# EAGLE design led+but (EAGLE 5.04)
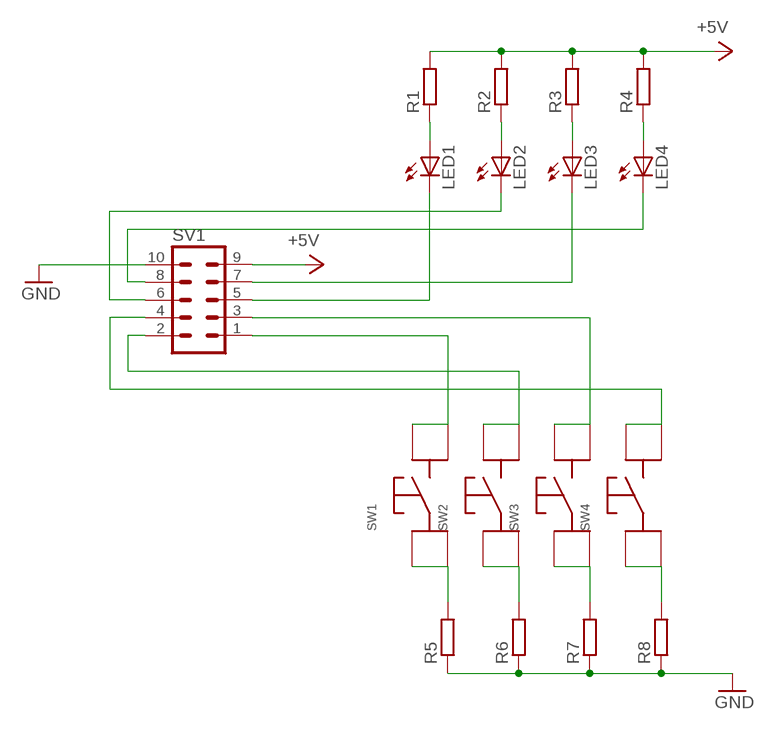
[diagram p0: schematic, sheet 1]

## Parts
LED1  LED3MM  [LED3MM]
LED2  LED3MM  [LED3MM]
LED3  LED3MM  [LED3MM]
LED4  LED3MM  [LED3MM]
R1  R-EU_R0805  [R0805]
R2  R-EU_R0805  [R0805]
R3  R-EU_R0805  [R0805]
R4  R-EU_R0805  [R0805]
R5  R-EU_R0805  [R0805]
R6  R-EU_R0805  [R0805]
R7  R-EU_R0805  [R0805]
R8  R-EU_R0805  [R0805]
SV1  MA05-2  [MA05-2]
SW1  PUSHBUTTON_6X6X5MM  [TACT_6X6X5MM]
SW2  PUSHBUTTON_6X6X5MM  [TACT_6X6X5MM]
SW3  PUSHBUTTON_6X6X5MM  [TACT_6X6X5MM]
SW4  PUSHBUTTON_6X6X5MM  [TACT_6X6X5MM]

## Nets
+5V: R1.2 R2.2 R3.2 R4.2 SV1.9
GND: R5.1 R6.1 R7.1 R8.1 SV1.10
N$1: R5.2 SW1.PIN1.1 SW1.PIN1.2
N$2: LED1.A R1.1
N$3: LED2.A R2.1
N$4: LED3.A R3.1
N$5: LED4.A R4.1
N$6: R6.2 SW2.PIN1.1 SW2.PIN1.2
N$7: R7.2 SW3.PIN1.1 SW3.PIN1.2
N$8: R8.2 SW4.PIN1.1 SW4.PIN1.2
N$9: SV1.1 SW1.PIN2.1(PIN2,1) SW1.PIN2.2
N$10: SV1.2 SW2.PIN2.1(PIN2,1) SW2.PIN2.2
N$11: SV1.3 SW3.PIN2.1(PIN2,1) SW3.PIN2.2
N$12: SV1.4 SW4.PIN2.1(PIN2,1) SW4.PIN2.2
N$13: LED1.K(C) SV1.5
N$14: LED2.K(C) SV1.6
N$15: LED3.K(C) SV1.7
N$16: LED4.K(C) SV1.8

## Library data of the parts
LED1-LED4 = led:LED: LED OSRAM: - CHIPLED LG R971, LG N971, LY N971, LG Q971, LY Q971, LO R971, LY R971 LH N974, LH R974 LS Q976, LO Q976, LY Q976 LO Q996 - Hyper CHIPLED LW Q18S LB Q993, LB Q99A, LB R99A - SideLED LS A670, LO A670, LY A670, LG A670, LP A670 LB A673, LV A673, LT A673, LW A673 LH A674 LY A675 LS A676, LA A676, LO A676, LY A676, LW A676 LS A679, LY A679, LG A679 - Hyper Micro SIDELED® LS Y876, LA Y876, LO Y876, LY Y876 LT Y87S - SmartLED LW L88C, LW L88S LB L89C, LB L89S, LG L890 LS L89K, LO L89K, LY L89K LS L896, LA L896, LO L896, LY L896 - TOPLED LS T670, LO T670, LY T670, LG T670, LP T670 LSG T670, LSP T670, LSY T670, LOP T670, LYG T670 LG T671, LOG T671, LSG T671 LB T673, LV T673, LT T673, LW T673 LH T674 LS T676, LA T676, LO T676, LY T676, LB T676, LH T676, LSB T676, LW T676 LB T67C, LV T67C, LT T67C, LS T67K, LO T67K, LY T67K, LW E67C LS E67B, LA E67B, LO E67B, LY E67B, LB E67C, LV E67C, LT E67C LW T67C LS T679, LY T679, LG T679 LS T770, LO T770, LY T770, LG T770, LP T770 LB T773, LV T773, LT T773, LW T773 LH T774 LS E675, LA E675, LY E675, LS T675 LS T776, LA T776, LO T776, LY T776, LB T776 LHGB T686 LT T68C, LB T68C - Hyper Mini TOPLED® LB M676 - Mini TOPLED Santana® LG M470 LS M47K, LO M47K, LY M47K Source: http://www.osram.convergy.de LUXEON: - LUMILED® LXK2-PW12-R00, LXK2-PW12-S00, LXK2-PW14-U00, LXK2-PW14-V00 LXK2-PM12-R00, LXK2-PM12-S00, LXK2-PM14-U00 LXK2-PE12-Q00, LXK2-PE12-R00, LXK2-PE12-S00, LXK2-PE14-T00, LXK2-PE14-U00 LXK2-PB12-K00, LXK2-PB12-L00, LXK2-PB12-M00, LXK2-PB14-N00, LXK2-PB14-P00, LXK2-PB14-Q00 LXK2-PR12-L00, LXK2-PR12-M00, LXK2-PR14-Q00, LXK2-PR14-R00 LXK2-PD12-Q00, LXK2-PD12-R00, LXK2-PD12-S00 LXK2-PH12-R00, LXK2-PH12-S00 LXK2-PL12-P00, LXK2-PL12-Q00, LXK2-PL12-R00 Source: www.luxeon.com KINGBRIGHT: KA-3528ASYC Source: www.kingbright.com
R1-R8 = rcl:R-EU_: RESISTOR, European symbol
SV1 = con-lstb:MA05-2: PIN HEADER
SW1-SW4 = button:PUSHBUTTON_6X6X5MM: PushButton 6x6x5mm

## Board
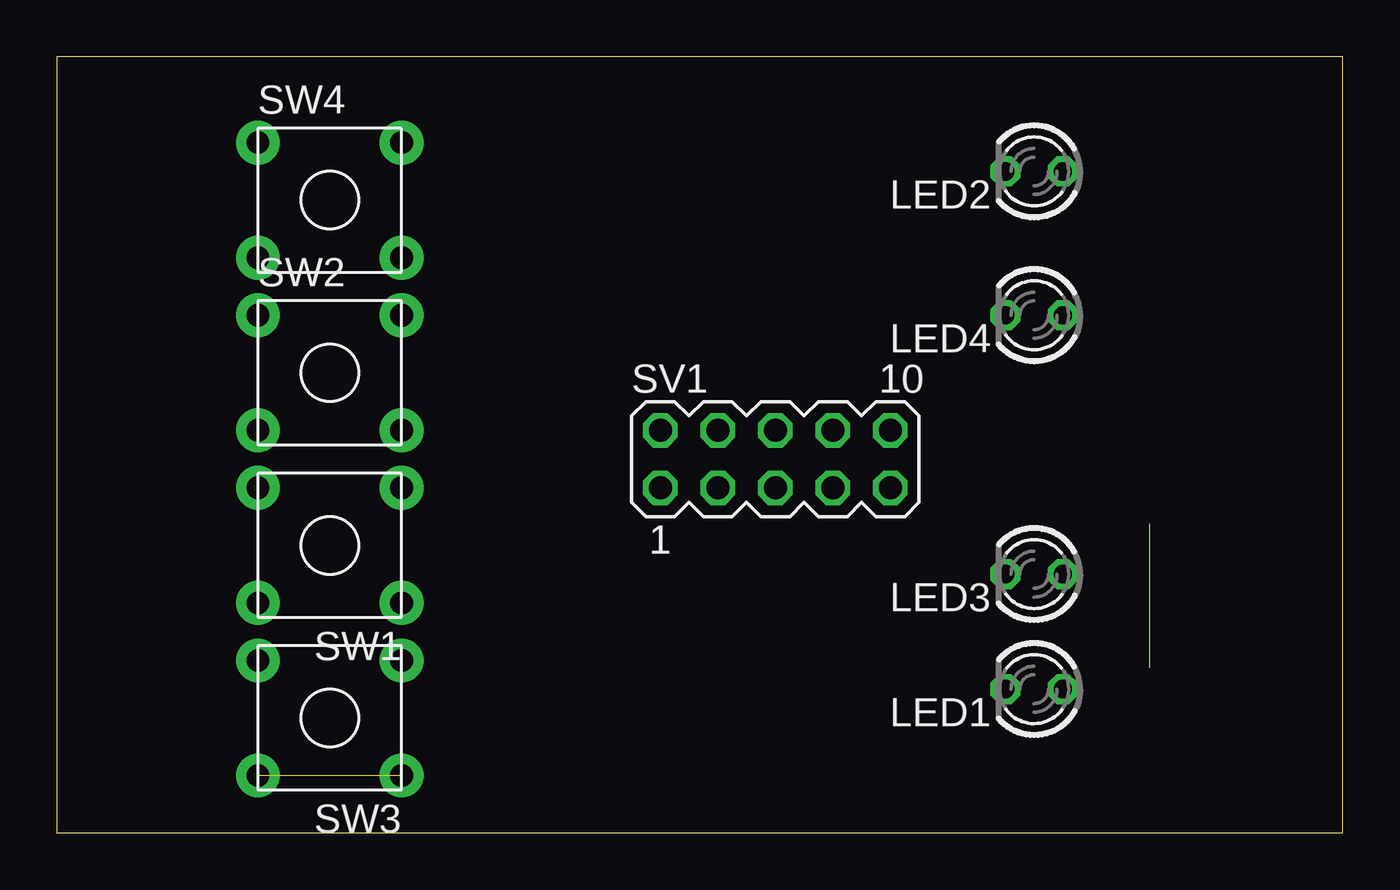
[diagram p1: board, top side]
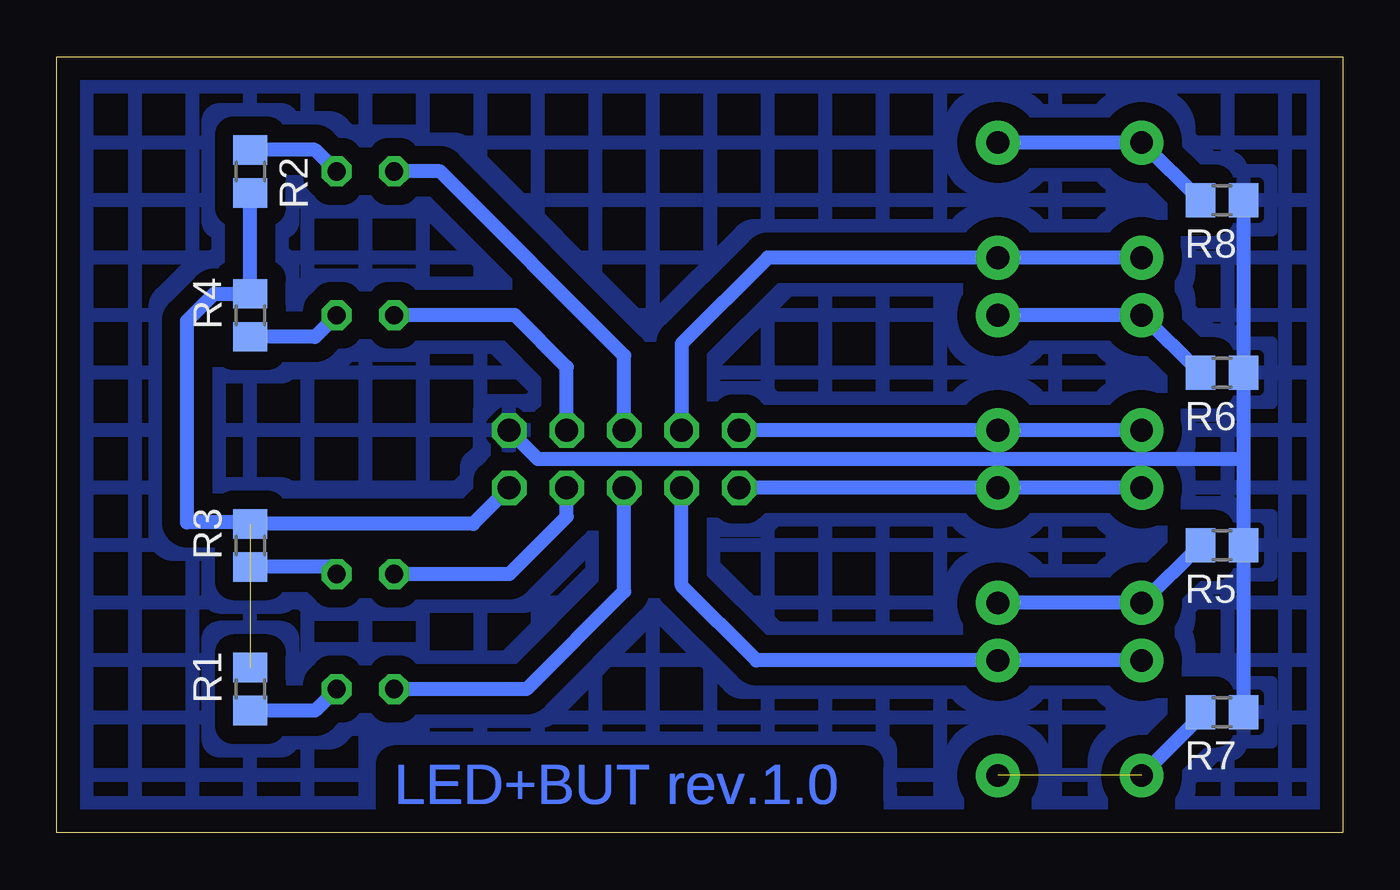
[diagram p2: board, bottom side, seen from below]

Size 56.82 x 34.28 mm. Coordinates in mm from the lower left corner, seen from the top.
Outline: 0,0 56.82,0 56.82,34.28 0,34.28 0,0
Copper layers (1*16): Top 0.035mm / dielectric 1.5mm / Bottom 0.035mm
Design rules "default": minimum track width 10mil, minimum drill 24mil, track to track 8mil, track to pad 8mil, pad to pad 8mil, via to via 8mil, smd to smd 8mil, copper to edge 40mil, drill to drill 8mil, minimum pad ring 10mil, minimum via ring 8mil, stop-mask expansion 4mil, vias tented up to drill 0mil, thermal gap 10mil

### Footprints (pad centres in the part's own frame; a part is rotated, then mirrored left to right if it is on the bottom)
LED3MM = drill 0.813 octagon: A -1.27,0; K 1.27,0
R0805 = smd 1.3 x 1.5: 1 -0.95,0; 2 0.95,0
MA05-2 = drill 1.016 octagon: 1 -5.08,-1.27; 2 -5.08,1.27; 3 -2.54,-1.27; 4 -2.54,1.27; 5 0,-1.27; 6 0,1.27; 7 2.54,-1.27; 8 2.54,1.27; 9 5.08,-1.27; 10 5.08,1.27
TACT_6X6X5MM = drill 1 pad 1.93 round: PIN1.1 0,0; PIN1.2 6.35,0; PIN2.1 0,-5.08; PIN2.2 6.35,-5.08

### Placement (x,y rotation side)
LED1  43.18,6.35 180 top
LED2  43.18,29.21 180 top
LED3  43.18,11.43 180 top
LED4  43.18,22.86 180 top
R1  48.26,6.35 90 bottom
R2  48.26,29.21 270 bottom
R3  48.26,12.7 90 bottom
R4  48.26,22.86 90 bottom
R5  5.33,12.7 180 bottom
R6  5.33,20.32 180 bottom
R7  5.33,5.33 180 bottom
R8  5.33,27.94 180 bottom
SV1  31.75,16.51 0 top
SW1  15.24,10.16 180 top
SW2  8.89,22.86 0 top
SW3  15.24,2.54 180 top
SW4  8.89,30.48 0 top

### Tracks (layer width: path | path; a pad name or v marks a point on that pad's centre or on a via)
+5V  (1 unrouted)
  Bottom 0.61: R2.2 R4.2 49.85,23.81 51.05,22.61 51.05,13.72 48.33,13.72 R3.2 38.42,13.65 SV1.9
GND
  Bottom 0.61: R6.1 R8.1 | 4.38,16.51 R5.1 R7.1 | 4.38,16.51 R6.1 | R6.1 4.32,20.32 | SV1.10 35.56,16.51 4.38,16.51
  pour Bottom (isolate 0.813, hatched): 0,34.29 55.88,34.29 55.88,0 0,0
N$1
  Bottom 0.61: SW1.PIN1.1 SW1.PIN1.2 R5.2
N$2
  Bottom 0.61: R1.1 45.4,5.4 LED1.A
N$3
  Bottom 0.61: R2.1 45.4,30.16 LED2.A
N$4
  Bottom 0.61: LED3.A 44.77,11.75 R3.1
N$5
  Bottom 0.61: R4.1 45.4,21.91 LED4.A
N$6
  Bottom 0.61: SW2.PIN1.2 SW2.PIN1.1 R6.2
N$7  (1 unrouted)
  Bottom 0.61: R7.2 6.28,5.15 SW3.PIN1.2
N$8
  Bottom 0.61: SW4.PIN1.2 SW4.PIN1.1 R8.2
N$9
  Bottom 0.61: SV1.1 SW1.PIN2.1 SW1.PIN2.2
N$10
  Bottom 0.61: SV1.2 SW2.PIN2.2 SW2.PIN2.1
N$11
  Bottom 0.61: SW3.PIN2.2 SW3.PIN2.1 25.91,7.62 29.21,10.92 SV1.3
N$12
  Bottom 0.61: SV1.4 29.21,21.59 25.4,25.4 SW4.PIN2.2 SW4.PIN2.1
N$13
  Bottom 0.61: LED1.K 36.07,6.35 31.75,10.67 SV1.5
N$14
  Bottom 0.61: LED2.K 39.88,29.21 31.75,21.08 SV1.6
N$15
  Bottom 0.61: SV1.7 34.29,13.97 36.83,11.43 LED3.K
N$16
  Bottom 0.61: LED4.K 36.58,22.86 34.29,20.57 SV1.8

### Text on the board
Bottom: LED+BUT rev.1.0 | LED+BUT rev.1.0 | LED+BUT rev.1.0 | LED+BUT rev.1.0 | LED+BUT rev.1.0